# EAGLE design teensyLC-midi-IO_01 has motor-drivers (EAGLE 7.5.0)
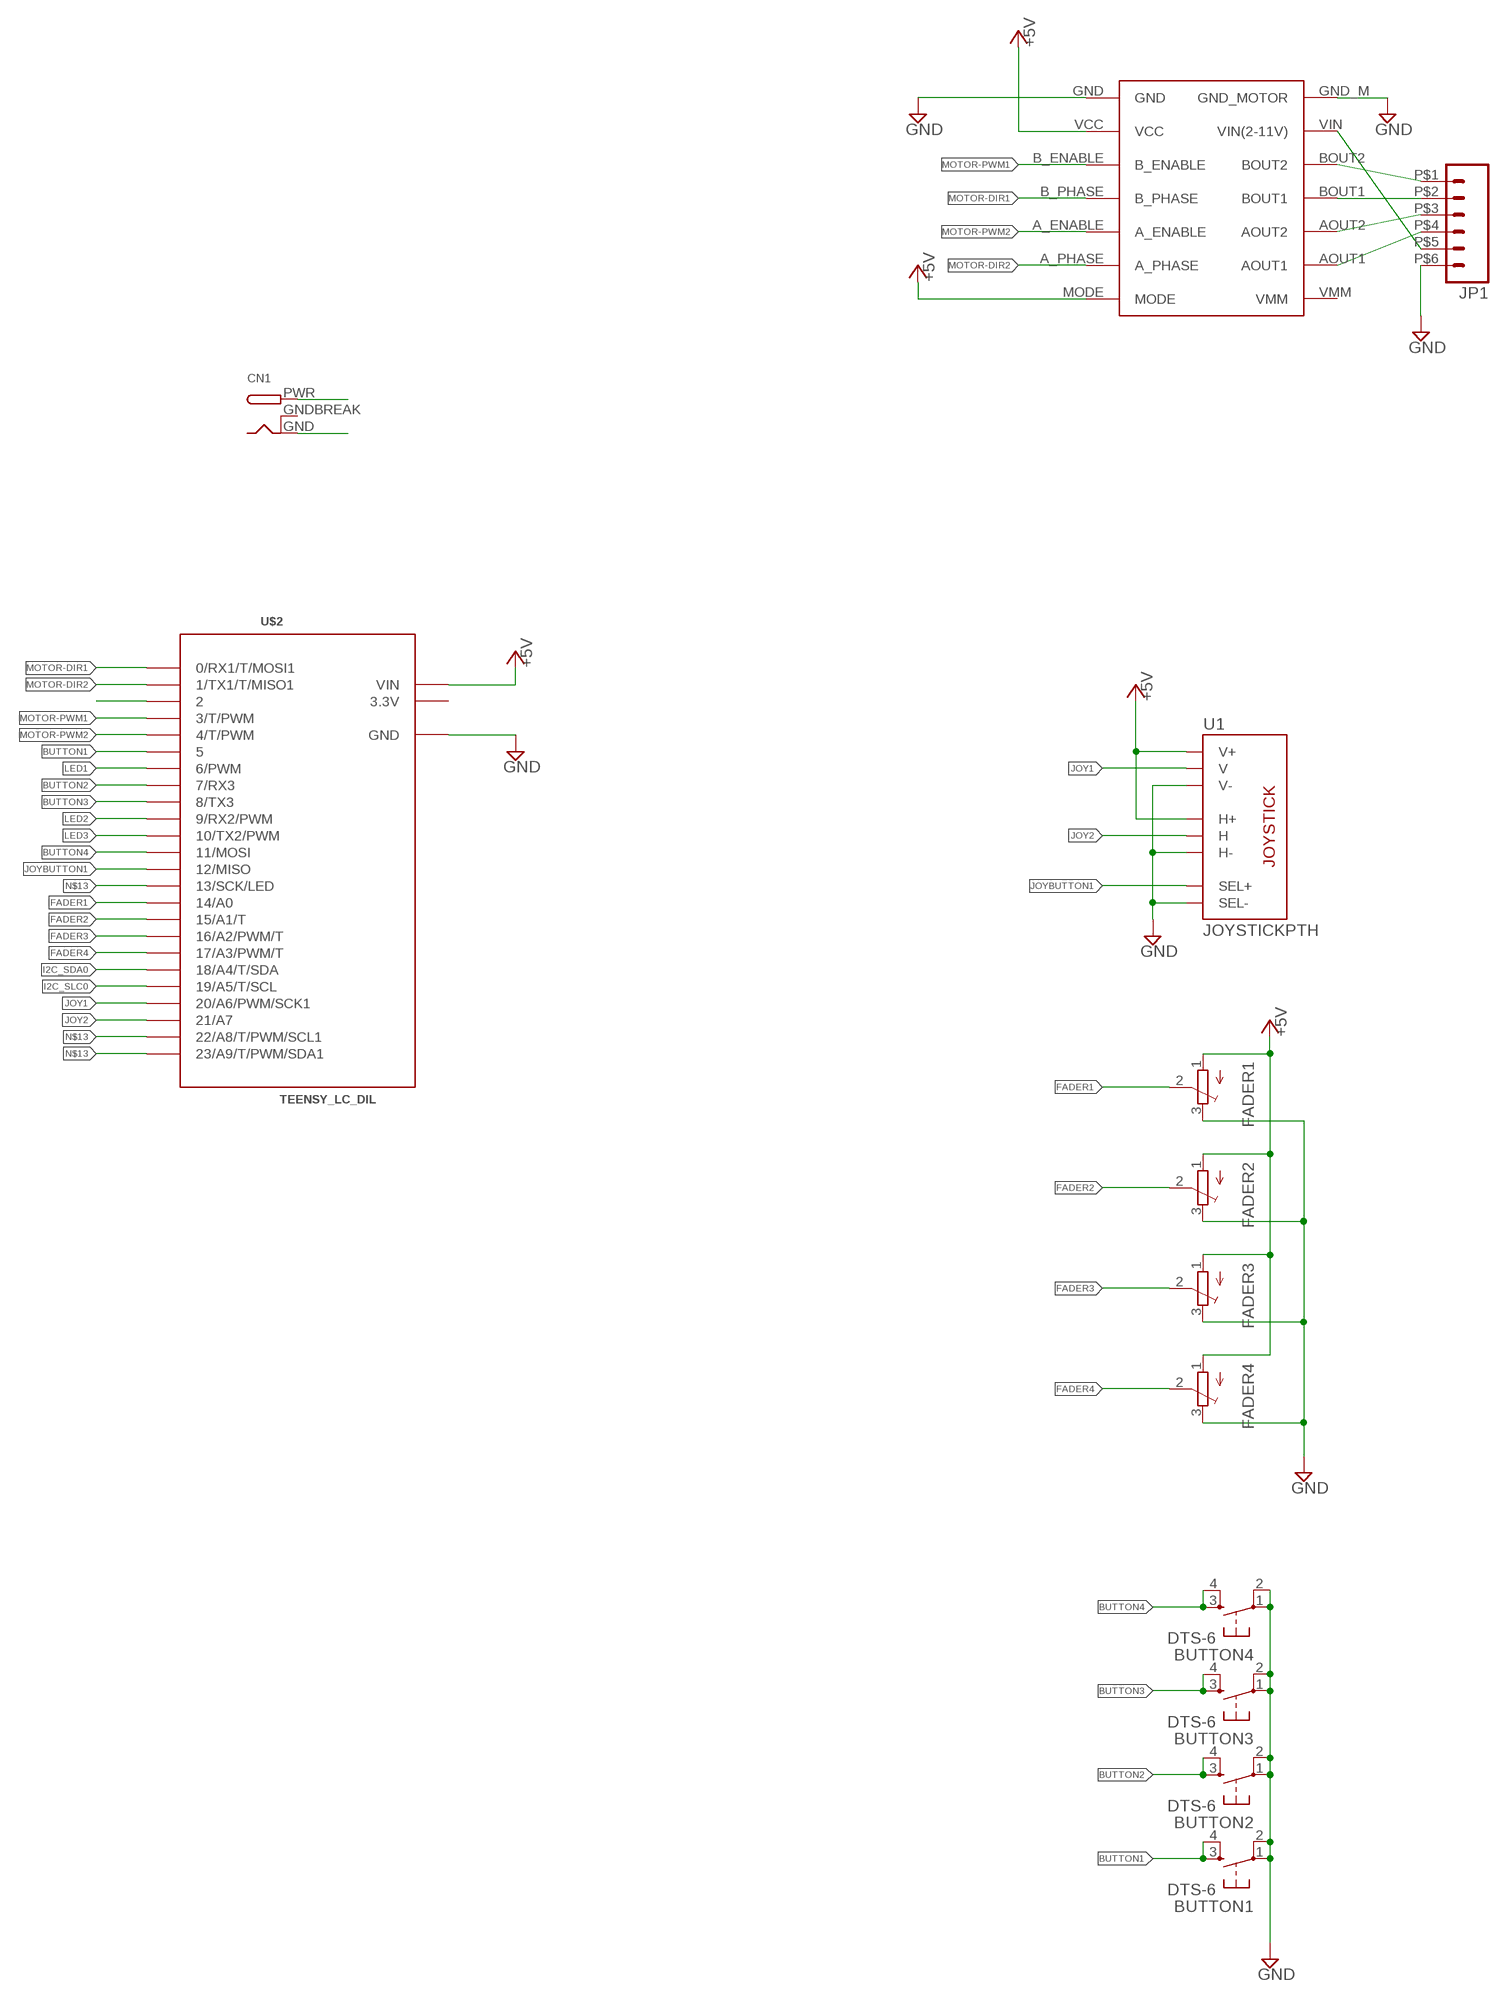
[diagram p0: schematic, sheet 1]

## Parts
BUTTON1  DTS-6  [DTS-6]
BUTTON2  DTS-6  [DTS-6]
BUTTON3  DTS-6  [DTS-6]
BUTTON4  DTS-6  [DTS-6]
CN1  DCBARRELPTH  [DCJACK_2MM_PTH]
DRV1  POLOLU_DRV8835  [POLOLU_DRV8835]
FADER1  TRIMPOT3386  [TRIM-3386]
FADER2  TRIMPOT3386  [TRIM-3386]
FADER3  TRIMPOT3386  [TRIM-3386]
FADER4  TRIMPOT3386  [TRIM-3386]
JP1  M06  [SPRINGTERMINAL-2.54MM-6]
U1  JOYSTICKPTH  [JOYSTICK]
U$2  TEENSY_LC_DIL  [TEENSY_3.0-3.2&LC_DIL]

## Nets
12V: CN1.PWR DRV1.VIN(VIN(2-11V)) JP1.P$5
+5V [Power]: DRV1.MODE DRV1.VCC FADER1.1(A) FADER2.1(A) FADER3.1(A) FADER4.1(A) U1.H1(H+) U1.V1(V+) U$2.VIN
ATTRU [GND]: JP1.P$6 ; supply symbol labelled GND
BUTTON1: BUTTON1.3 BUTTON1.4 U$2.2 U$2.5
BUTTON2: BUTTON2.3 BUTTON2.4 U$2.7(7/RX3)
BUTTON3: BUTTON3.3 BUTTON3.4 U$2.8(8/TX3)
BUTTON4: BUTTON4.3 BUTTON4.4 U$2.11(11/MOSI)
FADER1: FADER1.2(S) U$2.14/A0
FADER2: FADER2.2(S) U$2.15/A1(15/A1/T)
FADER3: FADER3.2(S) U$2.16/A2(16/A2/PWM/T)
FADER4: FADER4.2(S) U$2.17/A3(17/A3/PWM/T)
GND [GND]: BUTTON1.1 BUTTON1.2 BUTTON2.1 BUTTON2.2 BUTTON3.1 BUTTON3.2 BUTTON4.1 BUTTON4.2 CN1.GND DRV1.GND DRV1.GND_M(GND_MOTOR) FADER1.3(E) FADER2.3(E) FADER3.3(E) FADER4.3(E) U1.B2A(SEL-) U1.H3(H-) U1.V3(V-) U$2.AGND(GND) U$2.GND
I2C_SDA0: U$2.18/A4(18/A4/T/SDA)
I2C_SLC0: U$2.19/A5(19/A5/T/SCL)
JOY1: U1.V2(V) U$2.20/A6(20/A6/PWM/SCK1)
JOY2: U1.H2(H) U$2.21/A7
JOYBUTTON1: U1.B1A(SEL+) U$2.12(12/MISO)
LED1: U$2.6(6/PWM)
LED2: U$2.9(9/RX2/PWM)
LED3: U$2.10(10/TX2/PWM)
MOTOR-DIR1: DRV1.B_PHASE U$2.0(0/RX1/T/MOSI1)
MOTOR-DIR2: DRV1.A_PHASE U$2.1(1/TX1/T/MISO1)
MOTOR-PWM1: DRV1.B_ENABLE U$2.3(3/T/PWM)
MOTOR-PWM2: DRV1.A_ENABLE U$2.4(4/T/PWM)
N$5 [Power]: DRV1.AOUT1 JP1.P$4
N$6 [Power]: DRV1.AOUT2 JP1.P$3
N$7 [Power]: DRV1.BOUT1 JP1.P$2
N$8 [Power]: DRV1.BOUT2 JP1.P$1
N$13: U$2.13(13/SCK/LED) U$2.22/A8(22/A8/T/PWM/SCL1) U$2.23/A9(23/A9/T/PWM/SDA1)
Unconnected: DRV1.VMM

## Power pins joined to a net without a drawn wire
3.3V: U$2.3.3V
GNDBREAK: CN1.GNDBREAK

## Library data of the parts
BUTTON1-BUTTON4 = switch-tact:DTS-6
CN1 = adafruit:DCBARREL: 2.0mm DC Barrel Jack DCJACK_2MM_PTH - Through Hole Jack (4UConnector: 05537)
DRV1 = aliEagleLib:POLOLU_DRV8835
FADER1-FADER4 = adafruit:TRIMPOT: SMT trimmer potentiometer part number TC33X http://www.ladyada.net/library/eagle
JP1 = aliEagleLib:M06: Header 6 Standard 6-pin 0.1" header. Use with straight break away headers (SKU : PRT-00116), right angle break away headers (PRT-00553), swiss pins (PRT-00743), machine pins (PRT-00117), and female headers (PRT-00115). Molex polarized connector foot print use with SKU : PRT-08094 with associated crimp pins and housings. NOTES ON THE VARIANTS LOCK and LOCK_LONGPADS... This footprint was designed to help hold the alignment of a through-hole component (i.e. 6-pin header) while soldering it into place. You may notice that each hole has been shifted either up or down by 0.005 of an inch from it's more standard position (which is a perfectly straight line). This slight alteration caused the pins (the squares in the middle) to touch the edges of the holes. Because they are alternating, it causes a "brace" to hold the component in place. 0.005 has proven to be the perfect amount of "off-center" position when using our standard breakaway headers. Although looks a little odd when you look at the bare footprint, once you have a header in there, the alteration is very hard to notice. Also, if you push a header all the way into place, it is covered up entirely on the bottom side. This idea of altering the position of holes to aid alignment will be further integrated into the Sparkfun Library for other footprints. It can help hold any component with 3 or more connection pins.
U1 = adafruit:JOYSTICK: Thumb Joystick Joystick commonly found in PS2 controllers. Two pots and a select switch. Adapted from Sparkfun Library (but for more common 6mm switch sticks)
U$2 = Teensy_3_and_LC_Series_Boards_v1.4:TEENSY_LC_DIL

## Net classes
0 default: width 0.152 mm, clearance 0.152 mm
1 GND: width 0.508 mm, clearance 0.152 mm
2 Power: width 0.508 mm, clearance 0.152 mm

## Board
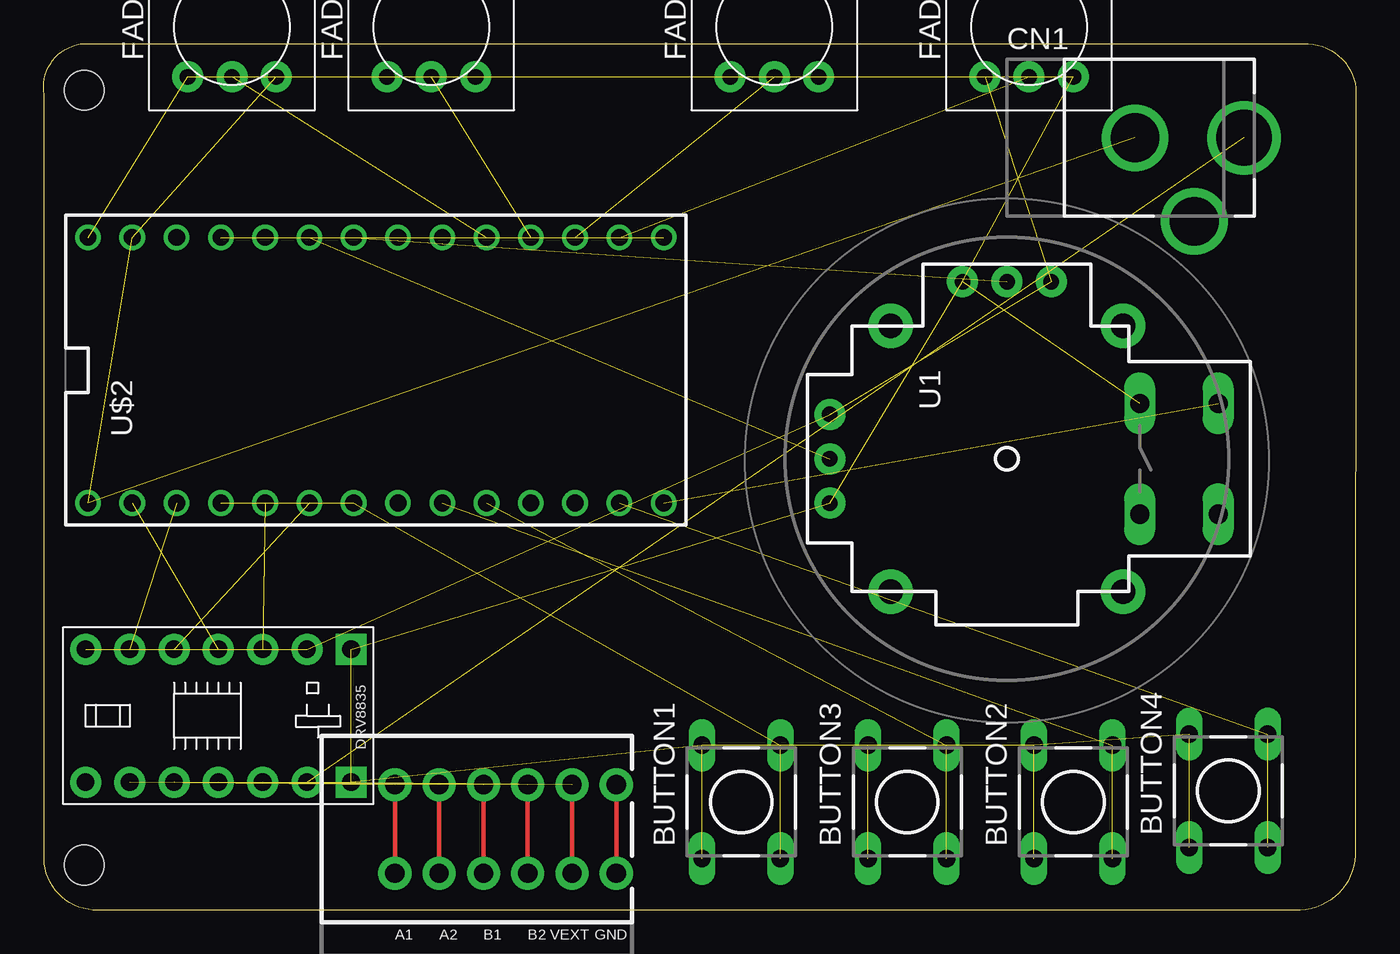
[diagram p1: board, top side]
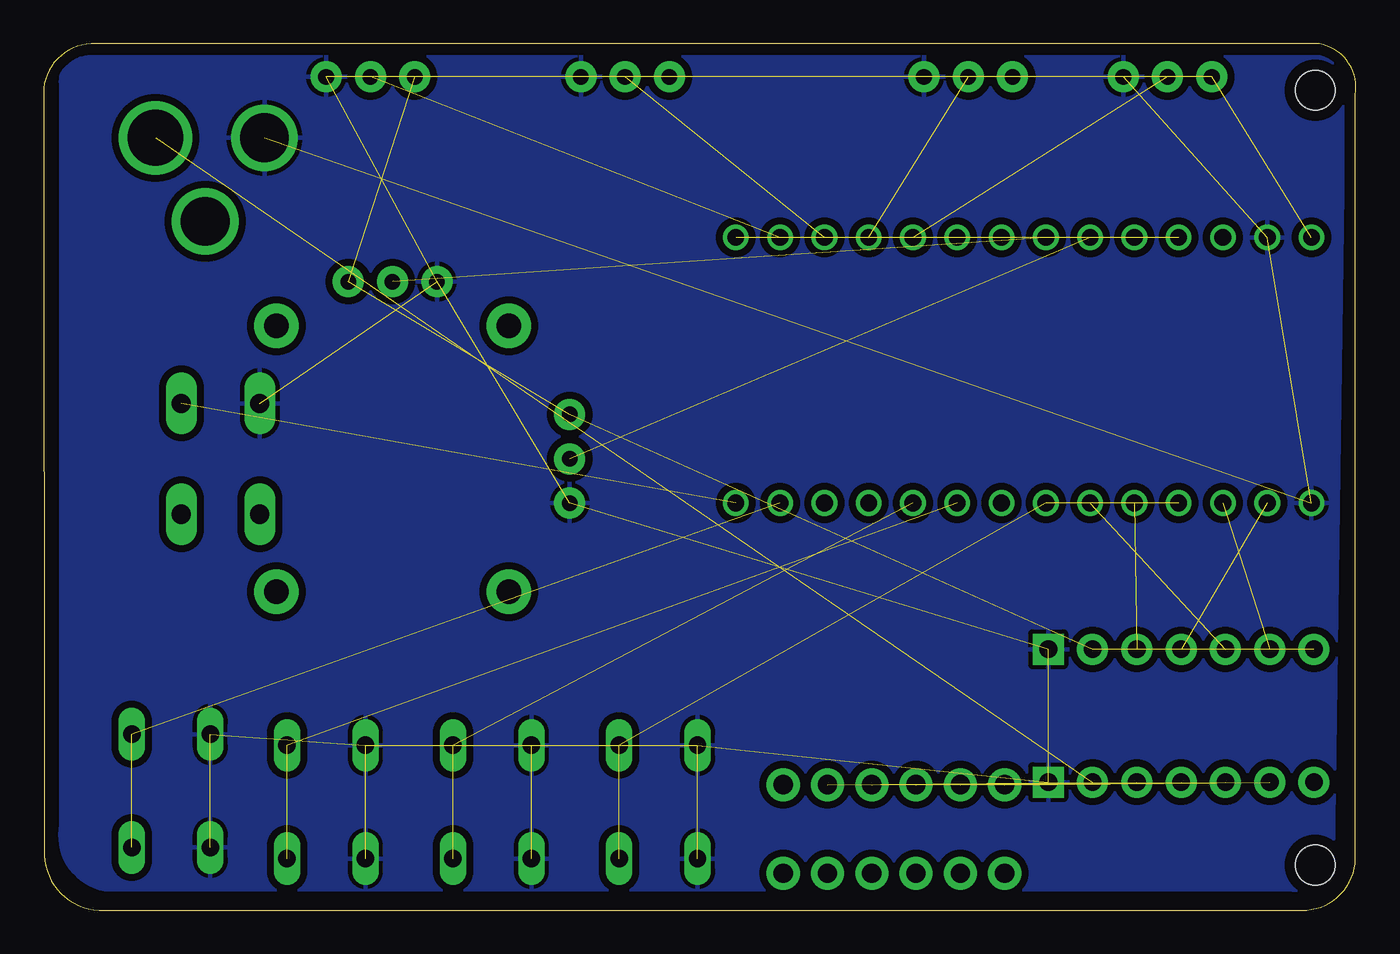
[diagram p2: board, bottom side, seen from below]

Size 75.27 x 49.72 mm. Coordinates in mm from the lower left corner, seen from the top.
Outline: 75.24,3.15 arc-90 71.79,0 2.83,0.01 arc-90 0.04,3.22 0.04,46.79 arc-90 2.09,49.7 72.01,49.7 arc-90 75.27,47.17 75.24,3.15
Copper layers (1*16): Top 0.035mm / dielectric 1.5mm / Bottom 0.035mm
Design rules "default *": minimum track width 16mil, minimum drill 16mil, track to track 16mil, track to pad 16mil, pad to pad 16mil, via to via 6mil, smd to smd 6mil, copper to edge 24mil, drill to drill 24mil, minimum pad ring 10mil, minimum via ring 8mil, stop-mask expansion 4mil, vias tented up to drill 0mil, thermal gap 10mil
Holes 2.26 mm at 2.34,2.59 2.33,47.04

### Footprints (pad centres in the part's own frame; a part is rotated, then mirrored left to right if it is on the bottom)
DTS-6 = drill 1 long: 1 -3.25,2.25; 2 3.25,2.25; 3 -3.25,-2.25; 4 3.25,-2.25
DCJACK_2MM_PTH = drill 2.8: GND 0,7.35; GNDBREAK 4.8,10.75 | drill 3.2: PWR 0,13.6
POLOLU_DRV8835 = drill 1.016 pad 1.778: A_ENABLE -3.81,-3.81; A_PHASE -3.81,-6.35; AOUT1 3.81,-6.35; AOUT2 3.81,-3.81; B_ENABLE -3.81,1.27; B_PHASE -3.81,-1.27; BOUT1 3.81,-1.27; BOUT2 3.81,1.27; MODE -3.81,-8.89; VCC -3.81,3.81; VIN 3.81,3.81; VMM 3.81,-8.89 | drill 1.016 pad 1.778 square: GND -3.81,6.35; GND_M 3.81,6.35
TRIM-3386 = drill 0.9 pad 1.778: 1 -2.54,-2.857; 2 0,-2.857; 3 2.54,-2.857
SPRINGTERMINAL-2.54MM-6 = drill 1.1 pad 1.9: 1 2.54,-2.54; 2 0,-2.54; 3 -2.54,-2.54; 4 -5.08,-2.54; 5 5.08,-2.54; 6 7.62,-2.54; P$1 2.54,2.54; P$2 0,2.54; P$3 -2.54,2.54; P$4 -5.08,2.54; P$5 5.08,2.54; P$6 7.62,2.54
JOYSTICK = drill 1.1 pad 1.778 long: B1A -3.175,12.12; B1B 3.175,12.12; B2A -3.175,7.62; B2B 3.175,7.62 | drill 0.889 pad 1.778: H1 -2.54,-10.16; H2 0,-10.16; H3 2.54,-10.16; V1 -10.16,2.54; V2 -10.16,0; V3 -10.16,-2.54 | drill 1.397 pad 2.54: MOUNT1 -7.62,6.668; MOUNT2 -7.62,-6.668; MOUNT3 7.62,-6.668; MOUNT4 7.62,6.668
TEENSY_3.0-3.2&LC_DIL = drill 0.965: 0 -7.62,13.97; 1 -7.62,11.43; 2 -7.62,8.89; 3 -7.62,6.35; 3.3V 7.62,11.43; 4 -7.62,3.81; 5 -7.62,1.27; 6 -7.62,-1.27; 7 -7.62,-3.81; 8 -7.62,-6.35; 9 -7.62,-8.89; 10 -7.62,-11.43; 11 -7.62,-13.97; 12 -7.62,-16.51; 13 7.62,-16.51; 14/A0 7.62,-13.97; 15/A1 7.62,-11.43; 16/A2 7.62,-8.89; 17/A3 7.62,-6.35; 18/A4 7.62,-3.81; 19/A5 7.62,-1.27; 20/A6 7.62,1.27; 21/A7 7.62,3.81; 22/A8 7.62,6.35; 23/A9 7.62,8.89; AGND 7.62,13.97; GND -7.62,16.51; VIN 7.62,16.51

### Placement (x,y rotation side)
BUTTON1  40.01,6.21 90 top
BUTTON2  59.06,6.21 90 top
BUTTON3  49.54,6.21 90 top
BUTTON4  67.95,6.85 90 top
CN1  55.25,44.31 270 top
DRV1  11.29,11.16 270 top
FADER1  56.52,50.66 0 top
FADER2  41.92,50.66 0 top
FADER3  22.23,50.66 0 top
FADER4  10.8,50.66 0 top
JP1  25.23,4.66 0 top
U1  55.25,25.9 270 top
U$2  19.06,30.98 90 top

### Tracks (layer width: path | path; a pad name or v marks a point on that pad's centre or on a via)
12V  (2 unrouted)
+5V  (8 unrouted)
BUTTON1  (3 unrouted)
BUTTON2  (2 unrouted)
BUTTON3  (2 unrouted)
BUTTON4  (2 unrouted)
FADER1  (1 unrouted)
FADER2  (1 unrouted)
FADER3  (1 unrouted)
FADER4  (1 unrouted)
GND  (19 unrouted)
  pour Bottom: 0.64,47.23 1.28,3.04 arc90 3.82,1.13 71.76,1.13 arc90 74.3,4.94 74.3,47.23 arc90 73.03,49.14 2.55,49.14 arc90
JOY1  (1 unrouted)
JOY2  (1 unrouted)
JOYBUTTON1  (1 unrouted)
MOTOR-DIR1  (1 unrouted)
MOTOR-DIR2  (1 unrouted)
MOTOR-PWM1  (1 unrouted)
MOTOR-PWM2  (1 unrouted)
N$5  (1 unrouted)
N$6  (1 unrouted)
N$7  (1 unrouted)
N$8  (1 unrouted)
N$13  (2 unrouted)